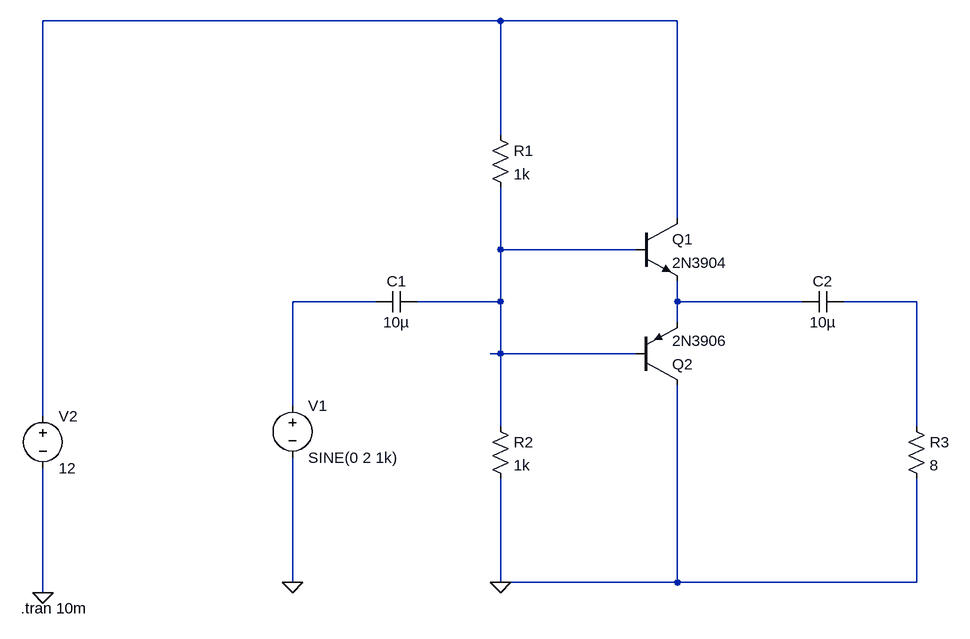
[diagram p0: schematic sim.asc]
sim.asc, the LTspice schematic file:
Version 4
SHEET 1 880 680
WIRE -32 -240 -736 -240
WIRE 240 -240 -32 -240
WIRE -32 -64 -32 -240
WIRE 240 64 240 -240
WIRE -32 112 -32 16
WIRE 176 112 -32 112
WIRE -224 192 -352 192
WIRE -32 192 -32 112
WIRE -32 192 -160 192
WIRE 240 192 240 160
WIRE 432 192 240 192
WIRE 608 192 496 192
WIRE 240 224 240 192
WIRE -32 272 -32 192
WIRE -32 272 -48 272
WIRE 176 272 -32 272
WIRE -352 352 -352 192
WIRE -736 368 -736 -240
WIRE -32 384 -32 272
WIRE 608 384 608 192
WIRE -352 624 -352 432
WIRE -32 624 -32 464
WIRE 240 624 240 320
WIRE 240 624 -32 624
WIRE 608 624 608 464
WIRE 608 624 240 624
WIRE -736 640 -736 448
FLAG -32 624 0
FLAG -352 624 0
FLAG -736 640 0
SYMBOL npn 176 64 R0
SYMATTR InstName Q1
SYMATTR Value 2N3904
SYMBOL pnp 176 320 M180
SYMATTR InstName Q2
SYMATTR Value 2N3906
SYMBOL res -48 -80 R0
SYMATTR InstName R1
SYMATTR Value 1k
SYMBOL res -48 368 R0
SYMATTR InstName R2
SYMATTR Value 1k
SYMBOL cap -160 176 R90
WINDOW 0 0 32 VBottom 2
WINDOW 3 32 32 VTop 2
SYMATTR InstName C1
SYMATTR Value 10µ
SYMBOL cap 496 176 R90
WINDOW 0 0 32 VBottom 2
WINDOW 3 32 32 VTop 2
SYMATTR InstName C2
SYMATTR Value 10µ
SYMBOL voltage -352 336 R0
WINDOW 123 0 0 Left 0
WINDOW 39 0 0 Left 0
SYMATTR InstName V1
SYMATTR Value SINE(0 2 1k)
SYMBOL res 592 368 R0
SYMATTR InstName R3
SYMATTR Value 8
SYMBOL voltage -736 352 R0
WINDOW 123 0 0 Left 0
WINDOW 39 0 0 Left 0
SYMATTR InstName V2
SYMATTR Value 12
TEXT -770 664 Left 2 !.tran 10m

The netlist it stands for:
* sim.asc
Q1 N001 N002 N004 0 2N3904
Q2 0 N002 N004 0 2N3906
R1 N001 N002 1k
R2 N002 0 1k
C1 N002 N003 10µ
C2 N005 N004 10µ
V1 N003 0 SINE(0 2 1k)
R3 N005 0 8
V2 N001 0 12
.model NPN NPN
.model PNP PNP
.lib standard.bjt
.tran 10m
.backanno
.end